# Altium schematic sheet VGA.SchDoc: Apalis Evaluation Board 1.1
size A3; Organization: Toradex AG; Address1: Altsagenstrasse 5; Address2: Horw; Address3: 6048; Address4: Switzerland; DocumentNumber: 20; Revision: V1.1; SheetNumber: 20; SheetTotal: 32; PageSetup: Record=PageOptions|CenterHorizontal=True|CenterVertical=True|PrintScale=0.73|XCorrection=1.00|YCorrection=1.00|PrintKind=0|BorderSize=5000000|LeftOffset=0|BottomOffset=0|Orientation=2|PaperLength=1000|PaperWidth=1000|Scale=100|PaperSource=7|PrintQuality=-4|MediaType=1|DitherType=10|PaperKind=A4|PrintScaleMode=1
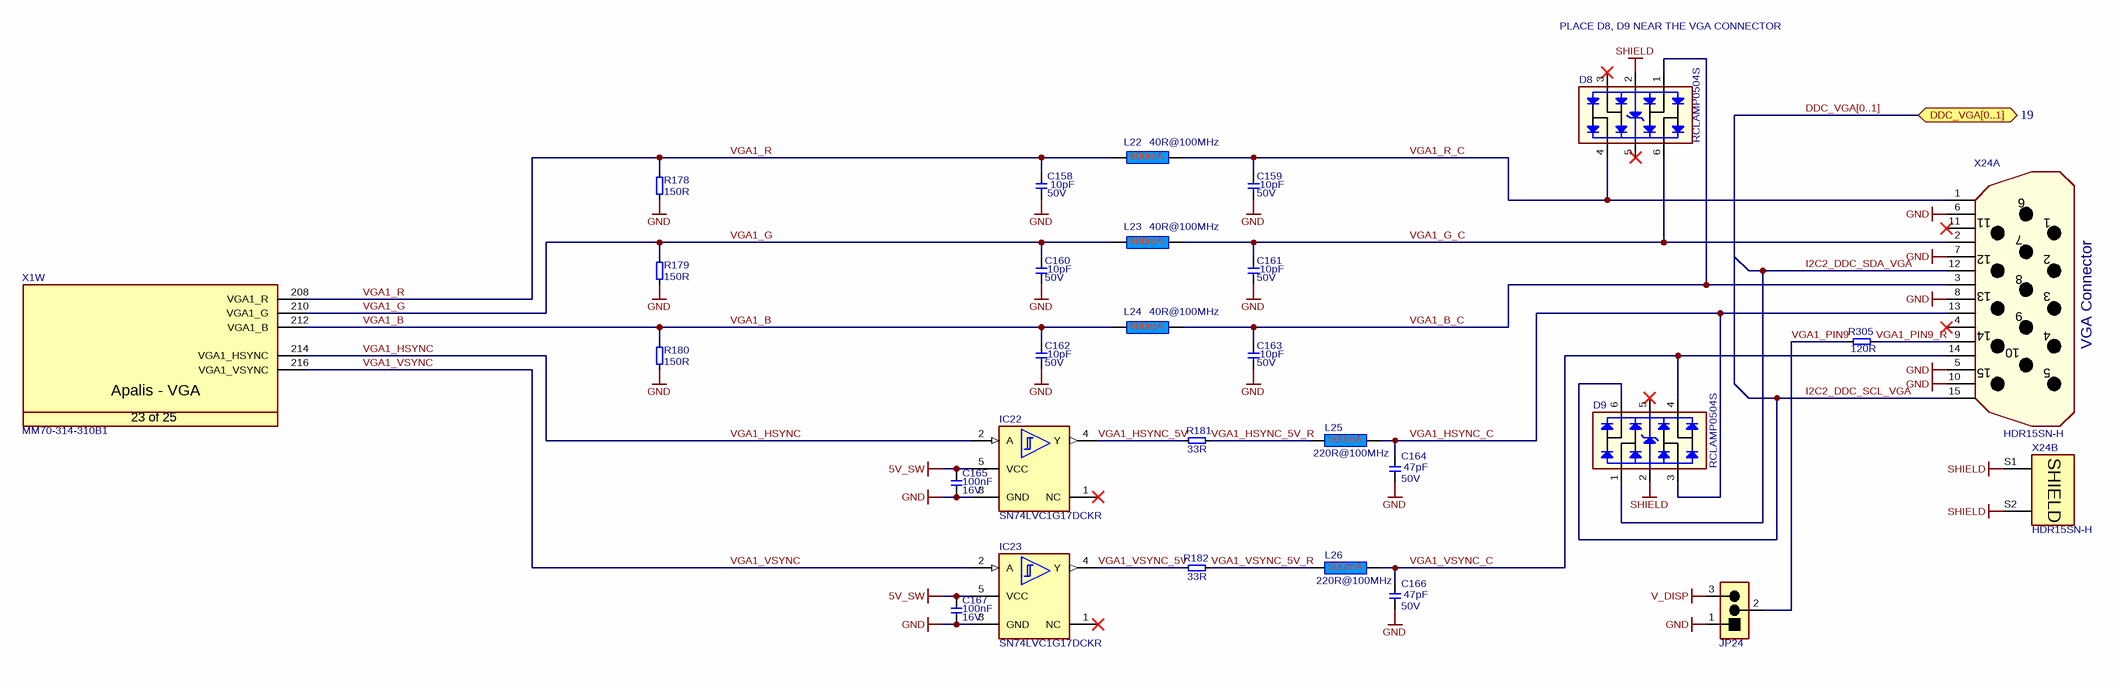
[diagram p0: VGA.SchDoc]

## Parts
C158  Rating: 50V  [T_CAPC0603X33N]  (hidden comment: 10pF)
C159  Rating: 50V  [T_CAPC0603X33N]  (hidden comment: 10pF)
C160  Rating: 50V  [T_CAPC0603X33N]  (hidden comment: 10pF)
C161  Rating: 50V  [T_CAPC0603X33N]  (hidden comment: 10pF)
C162  Rating: 50V  [T_CAPC0603X33N]  (hidden comment: 10pF)
C163  Rating: 50V  [T_CAPC0603X33N]  (hidden comment: 10pF)
C164  Rating: 50V  [T_CAPC0603X33N]  (hidden comment: 47pF)
C165  Rating: 16V  [T_CAPC0603X33N]  (hidden comment: 100nF)
C166  Rating: 50V  [T_CAPC0603X33N]  (hidden comment: 47pF)
C167  Rating: 16V  [T_CAPC0603X33N]  (hidden comment: 100nF)
D8  RCLAMP0504S  [T_SOT95P285X90-6N]
D9  RCLAMP0504S  [T_SOT95P285X90-6N]
IC22  SN74LVC1G17DCKR  [SOT65P210X110-5N]
IC23  SN74LVC1G17DCKR  [SOT65P210X110-5N]
JP24  826936-3  [T_TYCO_826936-3]  (value not drawn)
L22  40R@100MHz  [INDC1608X95N]
L23  40R@100MHz  [INDC1608X95N]
L24  40R@100MHz  [INDC1608X95N]
L25  220R@100MHz  [INDC1608X95N]
L26  220R@100MHz  [INDC1608X95N]
R178  150R  [T_RESC0603X30N]
R179  150R  [T_RESC0603X30N]
R180  150R  [T_RESC0603X30N]
R181  33R  [t_RESC0603X30N]
R182  33R  [t_RESC0603X30N]
R305  120R  [T_RESC0603X30N]
X1  Manufacturer Part No.: MM70-314-310B1  [T_JAE_MM70-314-310B1]  (hidden comment: CON-JAE-MM70-314-310B1-314-0.5mm)  (part W of 25)
X24  HDR15SN-H  [T_AUK_HDR15SN-H]  (parts A,B of 2)

## Ports
DDC_VGA[0..1] (bidir, see 19)

## Nets
5V_SW: C165.2 C167.2 IC22.5(VCC) IC23.5(VCC)
GND: C158.2 C159.2 C160.2 C161.2 C162.2 C163.2 C164.2 C165.1 C166.2 C167.1 IC22.3(GND) IC23.3(GND) JP24.1 R178.1 R179.1 R180.1 X24.5(GND) X24.6(DSR) X24.7(RTS) X24.8(CTS) X24.10(RI)
SHIELD: D8.2 D9.2 X24.S1(SHIELD) X24.S2(SHIELD)
V_DISP: JP24.3
I2C2_DDC_SCL_VGA: D9.6 X24.15(RI)
I2C2_DDC_SDA_VGA: D9.1 X24.12(RI)
VGA1_B: C162.1 L24.1 R180.2 X1.212(VGA1_B)
VGA1_B_C: C163.1 D8.1 L24.2 X24.3(TXD)
VGA1_G: C160.1 L23.1 R179.2 X1.210(VGA1_G)
VGA1_G_C: C161.1 D8.6 L23.2 X24.2(RXD)
VGA1_HSYNC: IC22.2(A) X1.214(VGA1_HSYNC)
VGA1_HSYNC_5V: IC22.4(Y) R181.1
VGA1_HSYNC_5V_R: L25.1 R181.2
VGA1_HSYNC_C: C164.1 D9.3 L25.2 X24.13(RI)
VGA1_PIN9: JP24.2 R305.1
VGA1_PIN9_R: R305.2 X24.9(RI)
VGA1_R: C158.1 L22.1 R178.2 X1.208(VGA1_R)
VGA1_R_C: C159.1 D8.4 L22.2 X24.1(DCD)
VGA1_VSYNC: IC23.2(A) X1.216(VGA1_VSYNC)
VGA1_VSYNC_5V: IC23.4(Y) R182.1
VGA1_VSYNC_5V_R: L26.1 R182.2
VGA1_VSYNC_C: C166.1 D9.4 L26.2 X24.14(RI)

Not connected (* = marked no-connect by the designer): D8 3* 5*; D9 5*; IC22 1(NC)*; IC23 1(NC)*; X24 4(DTR)* 11(RI)*

## Buses and harness runs
bus DDC_VGA[0..1] = port DDC_VGA[0..1]

## Notes on the sheet
- (near D8) PLACE D8, D9 NEAR THE VGA CONNECTOR
- VGA Connector
- Title
- Size:
- Date:
- A3
- Number:
- Time:
- Revision:
- Sheet
- of
- File:
- (in symbol CON-JAE-MM70-314-310B1-314-0.5mm, part W) Apalis - VGA; 23 of 25

## Library data of the parts
C158-C163 = C-NP0-10pF-50V-10%-0603: Capacitor Ceramic NP0 10pF 50V 10% 0603; Tolerance: 10%; Type: NP0; Value: 10pF
C164 C166 = C-NP0-47pF-50V-10%-0603: Capacitor Ceramic NP0 47pF 50V 10% 0603; Tolerance: 10%; Type: NP0; Value: 47pF
C165 C167 = C-X7R-100nF-16V-10%-0603: Capacitor Ceramic X7R 100nF 16V 10% 0603; Tolerance: 10%; Type: X7R; Value: 100nF
D8 D9 = D-Semtech-RClamp0504S: TVS Array low cap; Manufacturer Name: Semtech; Manufacturer Part No.: RCLAMP0504S
IC22 IC23 = IC-TI-SN74LVC1G17DCKR: Single Schmitt-Trigger Buffer; Manufacturer Name: Texas Instruments; Manufacturer Part No.: SN74LVC1G17DCKR
JP24 = CON-Tyco-826936-3-1X3-2.54mm-JP_1: Jumper, 3-Pin; Manufacturer Name: Tyco; No. of ways: 1X3; Pitch: 2.54mm; Manufacturer Part No.: 826936-3
L22-L24 = L-TDK-MMZ1608S400A-40R@100MHz-600mA-25%-0603: 40R@100MHz 600mA EMI FILTER; Manufacturer Name: TDK; Tolerance: 25%; Rating: 600mA; Manufacturer Part No.: MMZ1608S400A; Value: 40R@100MHz
L25 L26 = L-220R@100MHz-500mA-25%-0603: 220R@100MHz 500mA EMI FILTER; Tolerance: 25%; Rating: 500mA; Value: 220R@100MHz
R178-R180 = R-150R-63mW-1%-0603: Resistor 150 ohm 63mW 1% 0603; Rating: 63mW; Tolerance: 1%; Value: 150R
R181 R182 = R-33R-63mW-5%-0603: Resistor 33 ohm 63mW 5% 0603; Rating: 63mW; Tolerance: 5%; Value: 33R
R305 = R-120R-250mW-5%-0603: Resistor 120 ohm 250mW 5% 0603; Rating: 250mW; Tolerance: 5%; Value: 120R
X1 = CON-JAE-MM70-314-310B1-314-0.5mm: MXM3 Connector; Manufacturer Name: JAE; No. of ways: 314
X24 = CON-AUK-HDR15SN-H: 15 pin male D-SUB connector; Manufacturer Name: AUK; No. of ways: 15; Manufacturer Part No.: HDR15SN-H